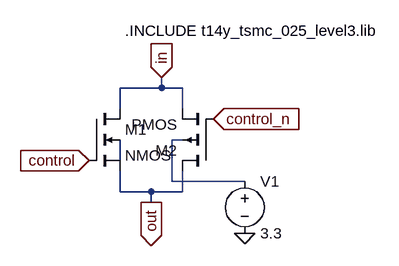
[diagram p0: schematic tg_gate.asc]
tg_gate.asc, the LTspice schematic file:
Version 4
SHEET 1 880 680
WIRE 240 96 240 80
WIRE 240 96 176 96
WIRE 272 96 240 96
WIRE 176 128 176 96
WIRE 272 128 272 96
WIRE 272 176 256 176
WIRE 176 208 176 176
WIRE 256 240 256 176
WIRE 368 240 256 240
WIRE 176 256 176 224
WIRE 224 256 176 256
WIRE 272 256 272 224
WIRE 272 256 224 256
WIRE 224 272 224 256
FLAG 368 320 0
FLAG 128 208 control
IOPIN 128 208 In
FLAG 320 144 control_n
IOPIN 320 144 In
FLAG 240 80 in
IOPIN 240 80 In
FLAG 224 272 out
IOPIN 224 272 Out
SYMBOL nmos4 128 128 R0
WINDOW 0 56 32 Left 0
WINDOW 3 56 72 Left 0
SYMATTR InstName M1
SYMATTR Value2 l=250n w=20u m=100
SYMBOL pmos4 320 224 R180
WINDOW 0 56 32 Left 0
WINDOW 3 56 72 Left 0
SYMATTR InstName M2
SYMATTR Value2 l=250u w=40u m=100
SYMBOL voltage 368 224 R0
WINDOW 123 0 0 Left 0
WINDOW 39 0 0 Left 0
SYMATTR InstName V1
SYMATTR Value 3.3
TEXT 184 8 Left 0 !.INCLUDE t14y_tsmc_025_level3.lib

The netlist it stands for:
* tg_gate.asc
M1 in control out N002 NMOS l=250n w=20u m=100
M2 out control_n in N001 PMOS l=250u w=40u m=100
V1 N001 0 3.3
.model NMOS NMOS
.model PMOS PMOS
.lib standard.mos
.INCLUDE t14y_tsmc_025_level3.lib
.backanno
.end